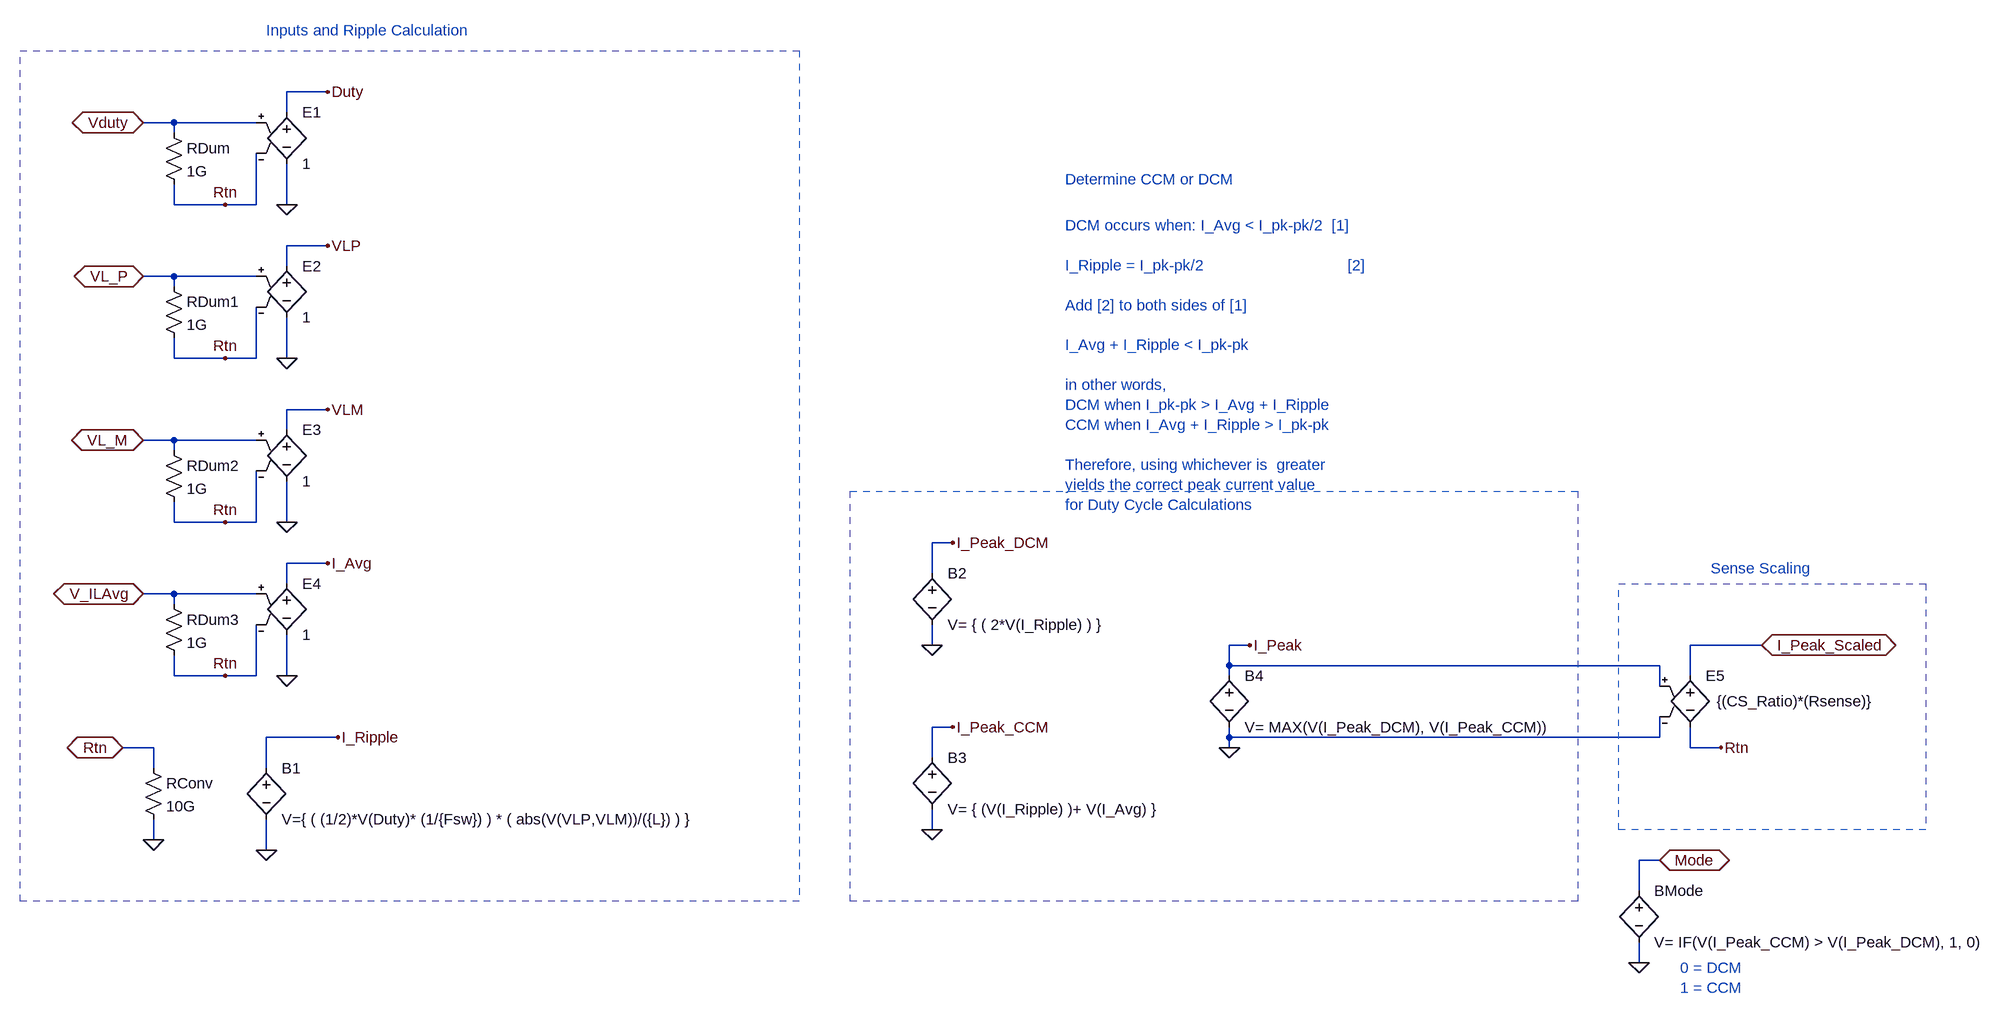
[diagram p0: schematic Peak_Current_Sense.asc]
Peak_Current_Sense.asc, the LTspice schematic file:
Version 4.1
SHEET 1 2956 1444
WIRE 336 32 272 32
WIRE 272 64 272 32
WIRE 96 80 48 80
WIRE 224 80 96 80
WIRE 96 96 96 80
WIRE 96 208 96 176
WIRE 176 208 96 208
WIRE 224 208 224 128
WIRE 224 208 176 208
WIRE 272 208 272 144
WIRE 336 272 272 272
WIRE 272 304 272 272
WIRE 96 320 48 320
WIRE 224 320 96 320
WIRE 96 336 96 320
WIRE 96 448 96 416
WIRE 176 448 96 448
WIRE 224 448 224 368
WIRE 224 448 176 448
WIRE 272 448 272 384
WIRE 336 528 272 528
WIRE 272 560 272 528
WIRE 96 576 48 576
WIRE 224 576 96 576
WIRE 96 592 96 576
WIRE 96 704 96 672
WIRE 176 704 96 704
WIRE 224 704 224 624
WIRE 224 704 176 704
WIRE 272 704 272 640
WIRE 1312 736 1280 736
WIRE 336 768 272 768
WIRE 1280 784 1280 736
WIRE 272 800 272 768
WIRE 96 816 48 816
WIRE 224 816 96 816
WIRE 96 832 96 816
WIRE 1280 896 1280 864
WIRE 1776 896 1744 896
WIRE 2576 896 2464 896
WIRE 1744 928 1744 896
WIRE 2416 928 1744 928
WIRE 96 944 96 912
WIRE 176 944 96 944
WIRE 224 944 224 864
WIRE 224 944 176 944
WIRE 272 944 272 880
WIRE 1744 944 1744 928
WIRE 2464 944 2464 896
WIRE 2416 960 2416 928
WIRE 1312 1024 1280 1024
WIRE 352 1040 240 1040
WIRE 1744 1040 1744 1024
WIRE 2416 1040 2416 1008
WIRE 2416 1040 1744 1040
WIRE 64 1056 16 1056
WIRE 1744 1056 1744 1040
WIRE 2464 1056 2464 1024
WIRE 2512 1056 2464 1056
WIRE 1280 1072 1280 1024
WIRE 64 1088 64 1056
WIRE 240 1088 240 1040
WIRE 1280 1184 1280 1152
WIRE 64 1200 64 1168
WIRE 240 1216 240 1168
WIRE 2416 1232 2384 1232
WIRE 2384 1280 2384 1232
WIRE 2384 1392 2384 1360
FLAG 176 208 Rtn
FLAG 16 1056 Rtn
IOPIN 16 1056 BiDir
FLAG 64 1200 0
FLAG 272 208 0
FLAG 336 32 Duty
FLAG 48 80 Vduty
IOPIN 48 80 BiDir
FLAG 176 448 Rtn
FLAG 272 448 0
FLAG 336 272 VLP
FLAG 48 320 VL_P
IOPIN 48 320 BiDir
FLAG 176 704 Rtn
FLAG 272 704 0
FLAG 336 528 VLM
FLAG 48 576 VL_M
IOPIN 48 576 BiDir
FLAG 176 944 Rtn
FLAG 272 944 0
FLAG 336 768 I_Avg
FLAG 48 816 V_ILAvg
IOPIN 48 816 BiDir
FLAG 240 1216 0
FLAG 352 1040 I_Ripple
FLAG 1280 896 0
FLAG 1312 736 I_Peak_DCM
FLAG 1280 1184 0
FLAG 1312 1024 I_Peak_CCM
FLAG 1744 1056 0
FLAG 1776 896 I_Peak
FLAG 2512 1056 Rtn
FLAG 2576 896 I_Peak_Scaled
IOPIN 2576 896 BiDir
FLAG 2384 1392 0
FLAG 2416 1232 Mode
IOPIN 2416 1232 BiDir
SYMBOL e 272 48 R0
SYMATTR InstName E1
SYMATTR Value 1
SYMBOL res 80 80 R0
SYMATTR InstName RDum
SYMATTR Value 1G
SYMBOL res 48 1072 R0
SYMATTR InstName RConv
SYMATTR Value 10G
SYMBOL e 272 288 R0
SYMATTR InstName E2
SYMATTR Value 1
SYMBOL res 80 320 R0
SYMATTR InstName RDum1
SYMATTR Value 1G
SYMBOL e 272 544 R0
SYMATTR InstName E3
SYMATTR Value 1
SYMBOL res 80 576 R0
SYMATTR InstName RDum2
SYMATTR Value 1G
SYMBOL e 272 784 R0
SYMATTR InstName E4
SYMATTR Value 1
SYMBOL res 80 816 R0
SYMATTR InstName RDum3
SYMATTR Value 1G
SYMBOL bv 240 1072 R0
SYMATTR InstName B1
SYMATTR Value V={ ( (1/2)*V(Duty)* (1/{Fsw}) ) * ( abs(V(VLP,VLM))/({L}) ) }
SYMBOL bv 1280 768 R0
SYMATTR InstName B2
SYMATTR Value V= { ( 2*V(I_Ripple) ) }
SYMBOL bv 1280 1056 R0
SYMATTR InstName B3
SYMATTR Value V= { (V(I_Ripple) )+ V(I_Avg) }
SYMBOL bv 1744 928 R0
SYMATTR InstName B4
SYMATTR Value V= MAX(V(I_Peak_DCM), V(I_Peak_CCM))
SYMBOL e 2464 928 R0
WINDOW 3 41 56 Left 2
SYMATTR Value {(CS_Ratio)*(Rsense)}
SYMATTR InstName E5
SYMBOL bv 2384 1264 R0
SYMATTR InstName BMode
SYMATTR Value V= IF(V(I_Peak_CCM) > V(I_Peak_DCM), 1, 0)
TEXT 1488 240 Left 2 ;DCM occurs when: I_Avg < I_pk-pk/2  [1]\n \nI_Ripple = I_pk-pk/2                                [2]\n  \nAdd [2] to both sides of [1]\n \nI_Avg + I_Ripple < I_pk-pk\n \nin other words,\nDCM when I_pk-pk > I_Avg + I_Ripple\nCCM when I_Avg + I_Ripple > I_pk-pk\n \nTherefore, using whichever is  greater\nyields the correct peak current value\nfor Duty Cycle Calculations
TEXT 1488 168 Left 2 ;Determine CCM or DCM
TEXT 240 -64 Left 2 ;Inputs and Ripple Calculation
TEXT 2496 776 Left 2 ;Sense Scaling
TEXT 2544 1400 Right 2 ;0 = DCM\n1 = CCM
RECTANGLE Normal 1072 1296 -144 -32 2
RECTANGLE Normal 2288 1296 1152 656 2
RECTANGLE Normal 2832 1184 2352 800 2

The netlist it stands for:
* Peak_Current_Sense.asc
E1 Duty 0 Vduty Rtn 1
RDum Vduty Rtn 1G
RConv Rtn 0 10G
E2 VLP 0 VL_P Rtn 1
RDum1 VL_P Rtn 1G
E3 VLM 0 VL_M Rtn 1
RDum2 VL_M Rtn 1G
E4 I_Avg 0 V_ILAvg Rtn 1
RDum3 V_ILAvg Rtn 1G
B1 I_Ripple 0 V={ ( (1/2)*V(Duty)* (1/{Fsw}) ) * ( abs(V(VLP,VLM))/({L}) ) }
B2 I_Peak_DCM 0 V= { ( 2*V(I_Ripple) ) }
B3 I_Peak_CCM 0 V= { (V(I_Ripple) )+ V(I_Avg) }
B4 I_Peak 0 V= MAX(V(I_Peak_DCM), V(I_Peak_CCM))
E5 I_Peak_Scaled Rtn I_Peak 0 {(CS_Ratio)*(Rsense)}
BMode Mode 0 V= IF(V(I_Peak_CCM) > V(I_Peak_DCM), 1, 0)
* DCM occurs when: I_Avg < I_pk-pk/2  [1]
* I_Ripple = I_pk-pk/2                                [2]
* Add [2] to both sides of [1]
* I_Avg + I_Ripple < I_pk-pk
* in other words,
* DCM when I_pk-pk > I_Avg + I_Ripple
* CCM when I_Avg + I_Ripple > I_pk-pk
* Therefore, using whichever is  greater
* yields the correct peak current value
* for Duty Cycle Calculations
* Determine CCM or DCM
* Inputs and Ripple Calculation
* Sense Scaling
* 0 = DCM
* 1 = CCM
.backanno
.end